# Altium schematic sheet MAX31865ATP.SchDoc
size A4; SheetNumber: 9; SheetTotal: 31
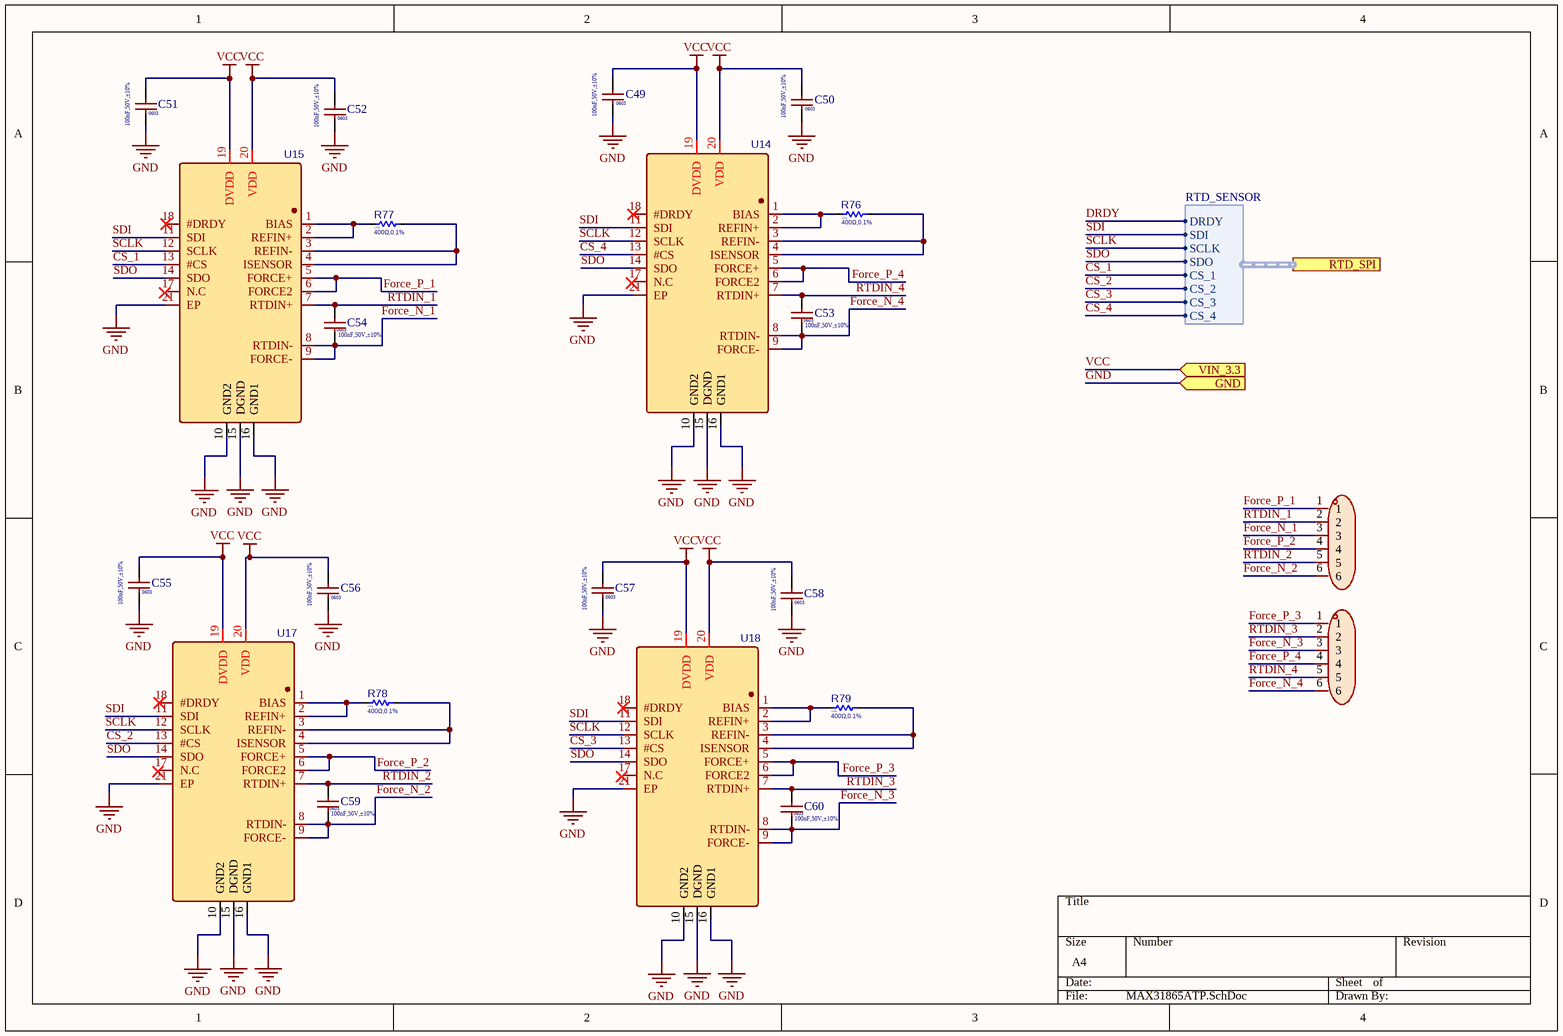
[diagram p0: MAX31865ATP.SchDoc]

## Parts
C49  value 100nF,50V,±10%  Package: 0603  [C0603]  (hidden comment: CL10B104KB8NNNC)
C50  value 100nF,50V,±10%  Package: 0603  [C0603]  (hidden comment: CL10B104KB8NNNC)
C51  value 100nF,50V,±10%  Package: 0603  [C0603]  (hidden comment: CL10B104KB8NNNC)
C52  value 100nF,50V,±10%  Package: 0603  [C0603]  (hidden comment: CL10B104KB8NNNC)
C53  value 100nF,50V,±10%  Package: 0603  [C0603]  (hidden comment: CL10B104KB8NNNC)
C54  value 100nF,50V,±10%  Package: 0603  [C0603]  (hidden comment: CL10B104KB8NNNC)
C55  value 100nF,50V,±10%  Package: 0603  [C0603]  (hidden comment: CL10B104KB8NNNC)
C56  value 100nF,50V,±10%  Package: 0603  [C0603]  (hidden comment: CL10B104KB8NNNC)
C57  value 100nF,50V,±10%  Package: 0603  [C0603]  (hidden comment: CL10B104KB8NNNC)
C58  value 100nF,50V,±10%  Package: 0603  [C0603]  (hidden comment: CL10B104KB8NNNC)
C59  value 100nF,50V,±10%  Package: 0603  [C0603]  (hidden comment: CL10B104KB8NNNC)
C60  value 100nF,50V,±10%  Package: 0603  [C0603]  (hidden comment: CL10B104KB8NNNC)
R76  value 400Ω,0.1%  Package: 1206  [R1206]  (hidden comment: 400Ω)
R77  value 400Ω,0.1%  Package: 1206  [R1206]  (hidden comment: 400Ω)
R78  value 400Ω,0.1%  Package: 1206  [R1206]  (hidden comment: 400Ω)
R79  value 400Ω,0.1%  Package: 1206  [R1206]  (hidden comment: 400Ω)
U14  MAX31865ATP+T  [QFN-20-EP(5x5)]  (value not drawn)
U15  MAX31865ATP+T  [QFN-20-EP(5x5)]  (value not drawn)
U16  DBT50G-6.35-6P-BK-P OGC  [6P_P=6.35mm]  (value not drawn)
U17  MAX31865ATP+T  [QFN-20-EP(5x5)]  (value not drawn)
U18  MAX31865ATP+T  [QFN-20-EP(5x5)]  (value not drawn)
U19  DBT50G-6.35-6P-BK-P OGC  [6P_P=6.35mm]  (value not drawn)

## Ports
GND (in), RTD_SPI (harness RTD_SENSOR), VIN_3.3 (in)

## Harnesses
RTD_SENSOR: DRDY, SDI, SCLK, CS_1, CS_2, CS_3, CS_4, SDO

## Nets
GND: C49.1 C50.1 C51.1 C52.1 C55.1 C56.1 C57.1 C58.1 U14.10(GND2) U14.15(DGND) U14.16(GND1) U14.21(EP) U15.10(GND2) U15.15(DGND) U15.16(GND1) U15.21(EP) U17.10(GND2) U17.15(DGND) U17.16(GND1) U17.21(EP) U18.10(GND2) U18.15(DGND) U18.16(GND1) U18.21(EP) ; port GND
VCC: C49.2 C50.2 C51.2 C52.2 C55.2 C56.2 C57.2 C58.2 U14.19(DVDD) U14.20(VDD) U15.19(DVDD) U15.20(VDD) U17.19(DVDD) U17.20(VDD) U18.19(DVDD) U18.20(VDD) ; port VIN_3.3
CS_1: U15.13(#CS) ; port RTD_SPI.CS_1
CS_2: U17.13(#CS) ; port RTD_SPI.CS_2
CS_3: U18.13(#CS) ; port RTD_SPI.CS_3
CS_4: U14.13(#CS) ; port RTD_SPI.CS_4
DRDY: port RTD_SPI.DRDY
Force_N_1: C54.2 U15.8(RTDIN-) U15.9(FORCE-) U16.3
Force_N_2: C59.2 U16.6 U17.8(RTDIN-) U17.9(FORCE-)
Force_N_3: C60.2 U18.8(RTDIN-) U18.9(FORCE-) U19.3
Force_N_4: C53.2 U14.8(RTDIN-) U14.9(FORCE-) U19.6
Force_P_1: U15.5(FORCE+) U15.6(FORCE2) U16.1
Force_P_2: U16.4 U17.5(FORCE+) U17.6(FORCE2)
Force_P_3: U18.5(FORCE+) U18.6(FORCE2) U19.1
Force_P_4: U14.5(FORCE+) U14.6(FORCE2) U19.4
RTDIN_1: C54.1 U15.7(RTDIN+) U16.2
RTDIN_2: C59.1 U16.5 U17.7(RTDIN+)
RTDIN_3: C60.1 U18.7(RTDIN+) U19.2
RTDIN_4: C53.1 U14.7(RTDIN+) U19.5
SCLK: U14.12(SCLK) U15.12(SCLK) U17.12(SCLK) U18.12(SCLK) ; port RTD_SPI.SCLK
SDI: U14.11(SDI) U15.11(SDI) U17.11(SDI) U18.11(SDI) ; port RTD_SPI.SDI
SDO: U14.14(SDO) U15.14(SDO) U17.14(SDO) U18.14(SDO) ; port RTD_SPI.SDO
NetR76_1: R76.1 U14.3(REFIN-) U14.4(ISENSOR)
NetR76_2: R76.2 U14.1(BIAS) U14.2(REFIN+)
NetR77_1: R77.1 U15.3(REFIN-) U15.4(ISENSOR)
NetR77_2: R77.2 U15.1(BIAS) U15.2(REFIN+)
NetR78_1: R78.1 U17.3(REFIN-) U17.4(ISENSOR)
NetR78_2: R78.2 U17.1(BIAS) U17.2(REFIN+)
NetR79_1: R79.1 U18.3(REFIN-) U18.4(ISENSOR)
NetR79_2: R79.2 U18.1(BIAS) U18.2(REFIN+)

Not connected (* = marked no-connect by the designer): U14 17(N.C) 18(#DRDY)*; U15 17(N.C) 18(#DRDY)*; U17 17(N.C) 18(#DRDY)*; U18 17(N.C) 18(#DRDY)*

## Library data of the parts
C49-C60 = CL10B104KB8NNNC: 50V 100nF X7R ±10% 0603 Multilayer Ceramic Capacitors MLCC - SMD/SMT ROHS; Manufacturer: SAMSUNG; Max Operating Temp: 125; Min Operating Temp: -55; MPN: CL10B104KB8NNNC; Datasheet: https://datasheet.lcsc.com/lcsc/2304140030_Samsung-Electro-Mechanics-CL10B104KB8NNNC_C1591.pdf; LCSC: C1591
R76-R79 = RT1206BRD07400RL: 250mW Thin Film Resistor 200V ±25ppm/℃ ±0.1% 400Ω 1206 Chip Resistor - Surface Mount ROHS; Manufacturer: YAGEO; Max Operating Temp: +155; Datasheet: https://www.lcsc.com/datasheet/lcsc_datasheet_2010201834_YAGEO-RT1206BRD07400RL_C706413.pdf; MPN: RT1206BRD07400RL; Min Operating Temp: -55; LCSC: C706413
U14 U15 U17 U18 = MAX31865ATP+T: QFN-20-EP(5x5) Analog to Digital Converters (ADC) ROHS; Manufacturer: ADI/MAXIM; LCSC: C118474; MPN: MAX31865ATP+T; Datasheet: *https://www.lcsc.com/datasheet/lcsc_datasheet_2304140030_Analog-Devices-Inc--Maxim-Integrated-MAX31865ATP-T_C118474.pdf; Package: QFN-20-EP(5x5)
U16 U19 = DBT50G-6.35-6P-BK-P OGC: 10A -40℃~+105℃ 300V Black 1x6P Corner Tri-face 22~16 6 1 6.35mm Plugin,P=6.35mm Barrier Terminal Blocks ROHS; Manufacturer: DORABO(地博电气); Supplier Part: C5179475; Manufacturer Part: DBT50G-6.35-6P-BK-P OGC; Supplier Footprint: 插件,P=6.35mm; Datasheet: https://atta.szlcsc.com/upload/public/pdf/source/20230321/4A82F27AE8A2F5607DB8D935518A4E7A.pdf; Operating Temperature Range: -40℃~+105℃